# EAGLE design Eharvest (EAGLE 6.5.0)
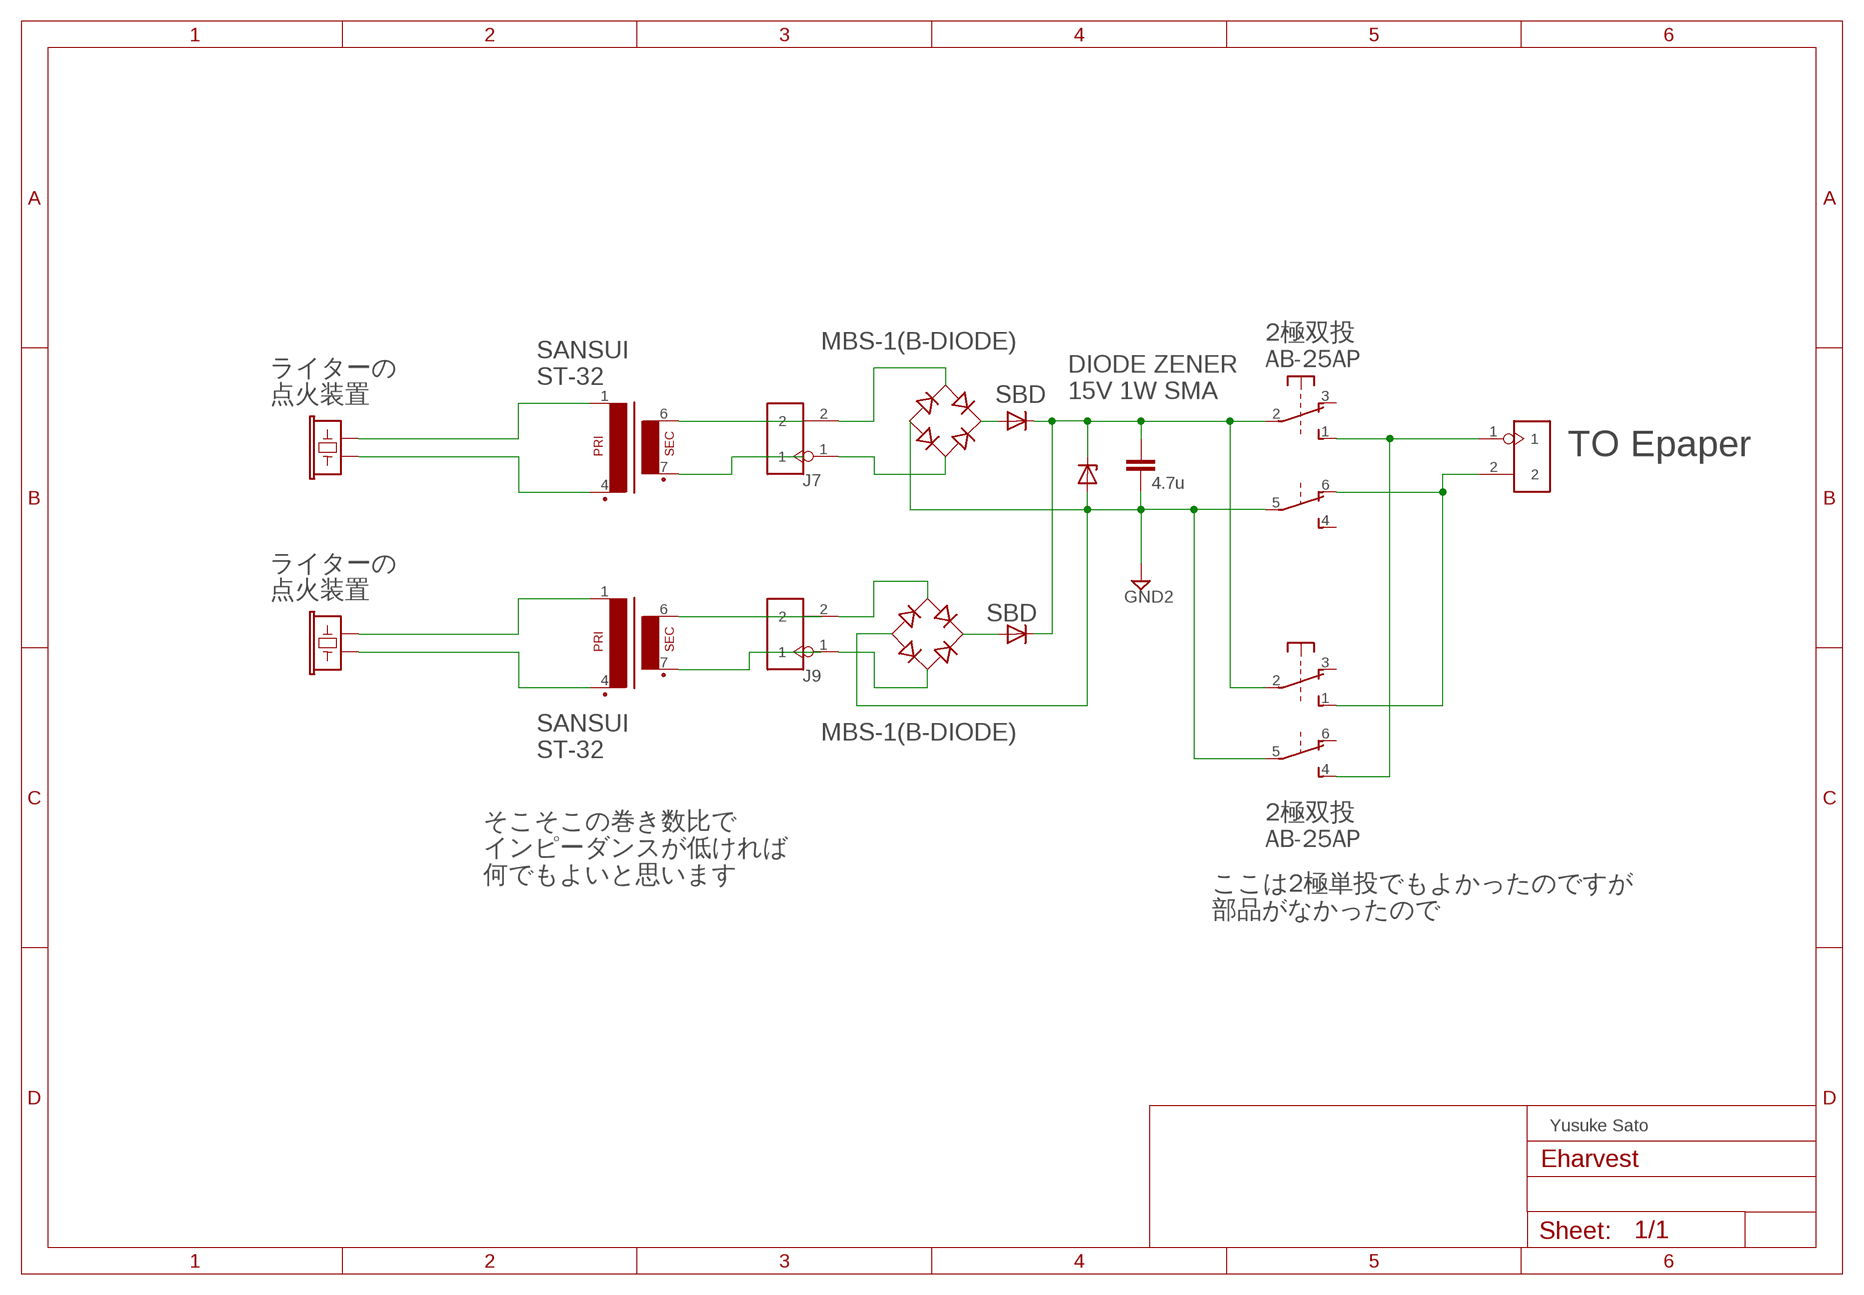
[diagram p0: schematic, sheet 1]

## Parts
C9  4.7u  C-EUC0402K  [C0402K]
D1  1N4728  [DO41Z10]
D5  MBS-1(B-DIODE)  [MBS-1(B-DIODE)]
D7  MBS-1(B-DIODE)  [MBS-1(B-DIODE)]
D8  DIODE-SOD123  [SOD123]
D9  DIODE-SOD123  [SOD123]
J7  HEADER-2P-65/35MIL  [2P-2.54-65/35MIL]
J8  HEADER-2P-65/35MIL  [2P-2.54-65/35MIL]
J9  HEADER-2P-65/35MIL  [2P-2.54-65/35MIL]
S1  9450-2  [9450-2]
S3  9450-2  [9450-2]
U$1  BV20_1P1S  [BV20]
U$2  BV20_1P1S  [BV20]
U$3  MICELECTRET_SMD  [MIC_ELECTRET_SMD]
U$4  MICELECTRET_SMD  [MIC_ELECTRET_SMD]

## Nets
ACIN3: D5.~(AC1) J7.2
ACIN4: D5.~1(AC2) J7.1
ACIN5: D7.~(AC1) J9.2
ACIN6: D7.~1(AC2) J9.1
GND2: C9.2 D1.A D5.- D7.- S1.5(2:P) S3.5(2:P)
N$3: U$1.6(S4)
N$4: C9.1 D1.C D8.C D9.C S1.2(1:P) S3.2(1:P)
N$5: U$1.7(S3)
N$6: J8.1 S1.4(2:S) S3.1(1:S)
N$8: J8.2 S1.1(1:S) S3.6(2:O)
N$9: U$2.7(S3)
N$10: U$2.6(S4)
N$11: D5.+ D8.A
N$12: U$1.1 U$3.2
N$13: U$1.4(P2) U$3.1
N$14: U$2.1 U$4.2
N$15: U$2.4(P2) U$4.1
N$16: D7.+ D9.A
Unconnected: S1.3(1:O) S1.6(2:O) S3.3(1:O) S3.4(2:S)

## Notes on the sheet
- 2極双投
  AB-25AP
- SANSUI 
  ST-32
- DIODE ZENER 
  15V 1W SMA
- ライターの
  点火装置
- SBD
- TO Epaper
- ライターの
  点火装置
- SBD
- SANSUI 
  ST-32
- 2極双投
  AB-25AP
- そこそこの巻き数比で
  インピーダンスが低ければ
  何でもよいと思います
- ここは2極単投でもよかったのですが
  部品がなかったので
- Yusuke Sato

## Library data of the parts
C9 = rcl:C-EU: CAPACITOR, European symbol
D1 = diode:1N4728: Z DIODE 3.3 V, 1W, 5 percent
D5 D7 = Utable:MBS-1(B-DIODE)
D8 D9 = diode:DIODE-: DIODE
J7-J9 = Connector :HEADER-2P
S1 S3 = switch-misc:9450-2: MARQUARDT SWITCH
U$1 U$2 = bv_20:BV20_1P1S
U$3 U$4 = SparkFun-Sensors:MIC: Omni-directional electret microphone. 9.7mm standard diameter.

## Board
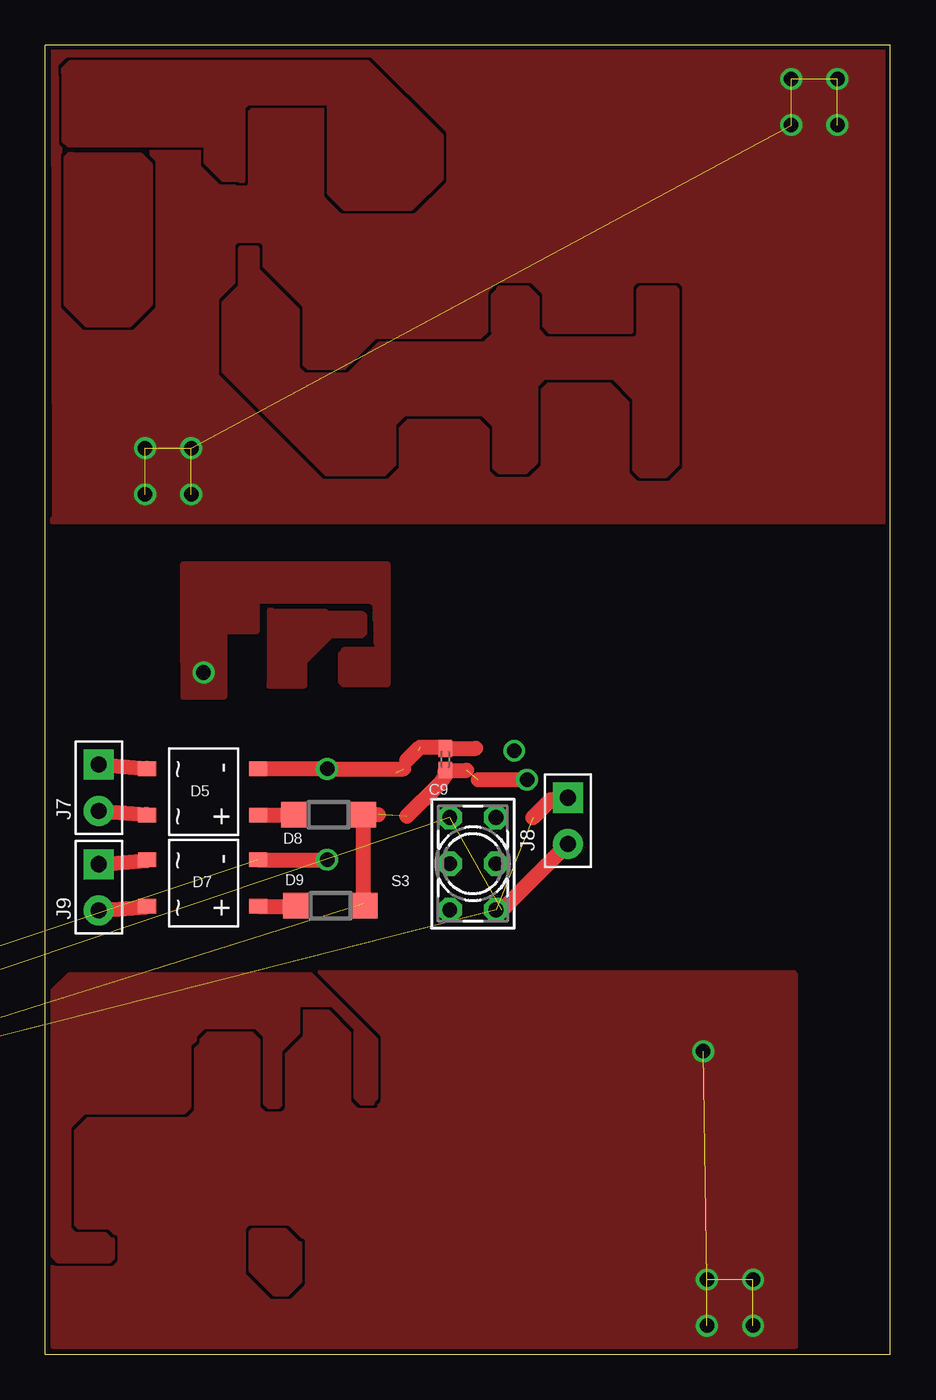
[diagram p1: board, top side]
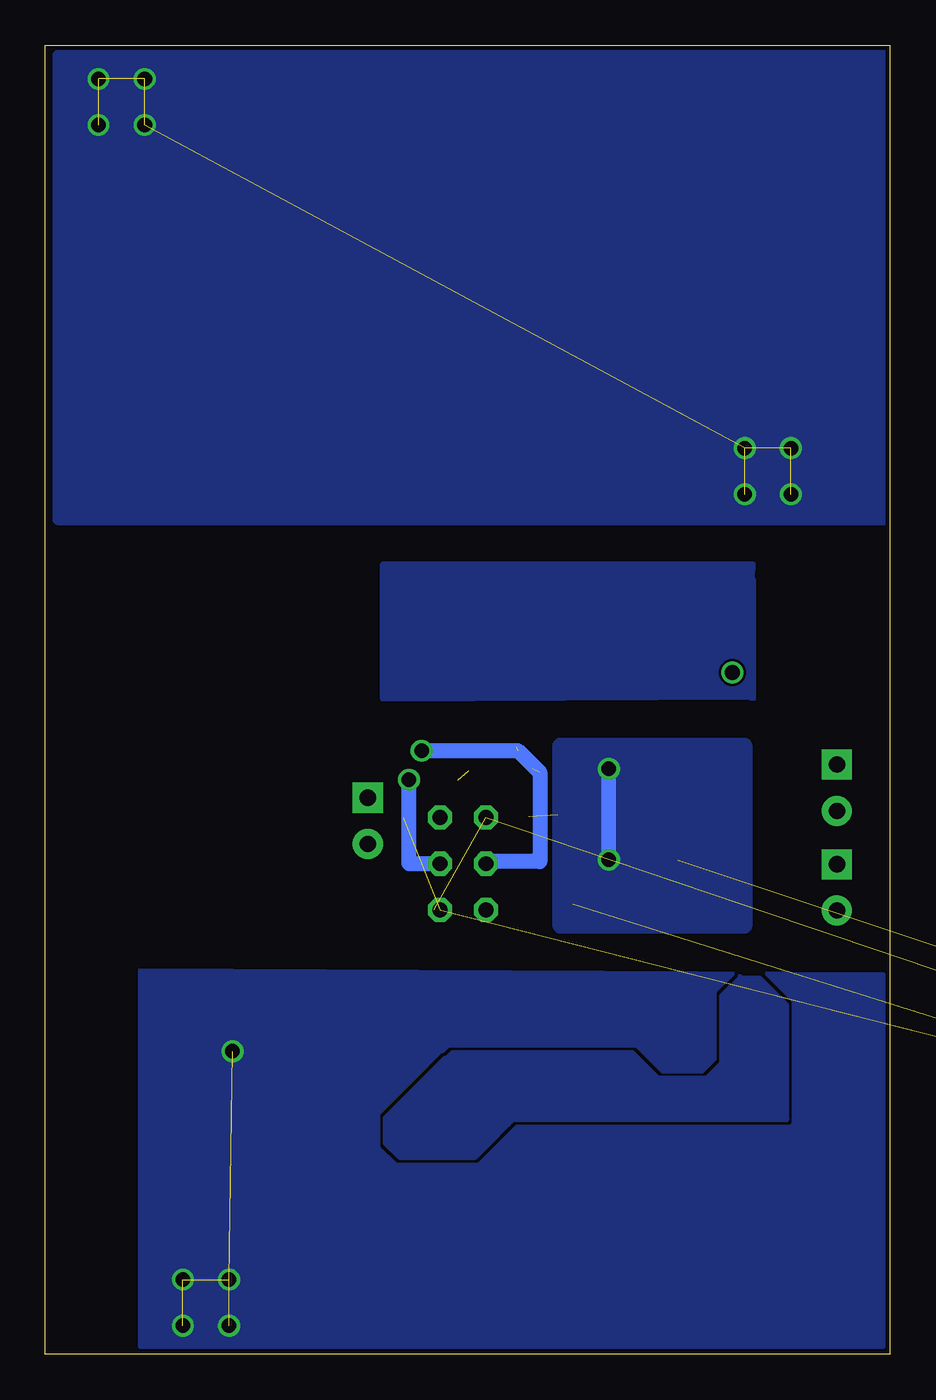
[diagram p2: board, bottom side, seen from below]

Size 46.5 x 72 mm. Coordinates in mm from the lower left corner, seen from the top.
Outline: 0,0 46.5,0 46.5,72 0,72 0,0
Copper layers (1*16): Top 0.035mm / dielectric 1.5mm / Bottom 0.035mm
Design rules "Fusion_eagle_rule_v1.1": minimum track width 6mil, minimum drill 12mil, track to track 6mil, track to pad 6mil, pad to pad 6mil, via to via 6mil, smd to smd 0mil, copper to edge 10mil, drill to drill 10mil, minimum pad ring 10mil, minimum via ring 6mil, stop-mask expansion 2mil, vias tented up to drill 100mil, thermal gap 10mil

### Footprints (pad centres in the part's own frame; a part is rotated, then mirrored left to right if it is on the bottom)
C0402K = smd 0.925 x 0.74: 1 -0.6,0; 2 0.6,0
DO41Z10 = drill 1.118: A 5.08,0; C -5.08,0
MBS-1(B-DIODE) = smd 0.8 x 1: + 0,0; - 2.55,0; ~ 0,6.1; ~1 2.55,6.1
SOD123 = smd 1.4 x 1.4: A 1.9,0; C -1.9,0
2P-2.54-65/35MIL = drill 0.889 pad 1.651 square: 1 0,1.27 | drill 0.889 pad 1.651: 2 0,-1.27
9450-2 = drill 0.813 octagon: 1 -2.54,-1.27; 2 0,-1.27; 3 2.54,-1.27; 4 -2.54,1.27; 5 0,1.27; 6 2.54,1.27
BV20 = drill 0.6 long: 1 -7.5,-7.5; 2 -7.5,-2.5; 3 -7.5,2.5; 4 -7.5,7.5; 5 7.5,7.5; 6 7.5,2.5; 7 7.5,-2.5; 8 7.5,-7.5
MIC_ELECTRET_SMD = smd 1.3 x 1.3: 1 0,0 | smd 0.75 x 0.75: 2 0,1.6

### Placement (x,y rotation side)
C9  22,32.72 90 top
D1  -71.12,-27.94 0 top  (outside the outline)
D5  11.7,29.66 90 top
D7  11.7,24.64 90 top
D8  15.58,29.68 180 top
D9  15.68,24.66 180 top
J7  2.94,31.16 0 top
J8  28.76,29.34 0 top
J9  2.94,25.68 0 top
S1  -73.66,-2.54 0 top  (outside the outline)
S3  23.52,26.98 90 top
U$1  -30.48,5.08 0 top  (outside the outline)
U$2  -55.88,5.08 0 top  (outside the outline)
U$3  -73.66,-12.7 0 top  (outside the outline)
U$4  -73.66,-20.32 0 top  (outside the outline)

### Tracks (layer width: path | path; a pad name or v marks a point on that pad's centre or on a via)
0V  (via drill 0.8)  (4 unrouted)
  other vias: 38.94,4.1 38.94,1.56 36.4,1.56 36.2,16.66 36.4,4.1
  pour Top (rank 2): 0.4,20.9 0.4,0.4 41.3,0.4 41.3,20.9 41.2,21 0.4,21
  pour Bottom (rank 2): 0.4,0.4 41.3,0.4 41.3,21.1 0.4,20.9
15V
  pour Top: 10.8,60.8 10.8,58.7 9.9,57.8 9.9,54.1 15.5,48.5 18.6,48.5 19.1,49 19.1,51.2 19.7,51.8 24.1,51.8 24.8,51.1 24.8,48.8 25,48.6 26.4,48.6 26.9,49.1 26.9,53.3 27.4,53.8 31.3,53.8 32.5,52.6 32.5,48.7 32.8,48.4 34.1,48.4 34.7,49 34.7,58.5 34.6,58.6 32.8,58.6 32.7,58.5 32.7,56 32.5,55.8 27.5,55.8 27,56.3 27,58.1 26.5,58.6 25,58.6 25,58.5 24.7,58.2 24.7,56.3 24.8,56.2 24.8,56.1 24.2,55.5 18.4,55.5 16.7,53.8 14.2,53.8 13.8,54.2 13.8,57.4 11.6,59.6 11.6,60.8
ACIN3
  Top 0.813: J7.2 5.57,29.69 D5.~
ACIN4
  Top 0.813: J7.1 5.58,32.23 D5.~1
ACIN5
  Top 0.813: J9.2 5.57,24.61 D7.~
ACIN6
  Top 0.813: J9.1 5.56,27.15 D7.~1
GND  (via drill 0.8)  (7 unrouted)
  other vias: 5.48,49.84 8.02,49.84 8.02,47.3 5.48,47.3 43.58,70.16 41.04,70.16 41.04,67.62 43.58,67.62
  pour Top (rank 2): 0.4,45.86 46.12,45.86 46.12,71.78 46.1,71.8 0.5,71.8 0.56,45.9 0.5,46
  pour Bottom: 0.3,71.7 0.4,45.8 45.8,45.8 45.9,45.9 45.9,71.5 45.8,71.6
GND2  (via drill 0.8)  (4 unrouted)
  Top 0.813: D7.- v15.49,27.19 v15.5,27.2 | 19.71,32.2 v15.5,32.2 15.39,32.21 D5.- | 19.88,32.66 20.62,33.4 21.92,33.4 C9.2 23.69,33.32 | 25.63,33.27 v25.8,33.2
  Bottom 0.813: v15.5,27.2 v15.5,32.2 | v25.8,33.2 20.5,33.2 19.3,32 19.3,27.1 22.13,27.1 S3.5
  pour Bottom: 8.02,33.5 8.02,23.54 18.18,23.54 18.18,33.5
GNDA  (via drill 0.8)
  other vias: 8.7,37.5
  pour Top: 7.6,39.9 7.6,43.4 18.8,43.4 18.8,36.9 16.4,36.9 16.3,37 16.3,38.5 16.5,38.7 18.3,38.7 18.2,41.3 17.9,41.5 11.7,41.5 11.6,41.4 11.6,39.8 9.76,39.78 9.8,39.74 9.8,36.2 7.62,36.18
N$1
  pour Top: 1.4,65.9 5.2,65.9 5.7,65.4 5.7,57.8 4.6,56.7 2.3,56.7 1.2,57.8 1.2,65.8 1.4,66
N$4  (via drill 0.8)  (4 unrouted)
  Top 0.813: D9.C 17.48,24.76 D8.C 18.33,29.68 | 19.88,29.58 21.7,31.4 22,31.82 C9.1 23.19,32.12 | v26.5,31.6 23.81,31.6
  Bottom 0.813: S3.2 26.48,26.98 26.5,27 v26.5,31.6
N$6  (2 unrouted)
  Top 0.813: 26.82,29.52 27.8,30.5 28.65,30.5 J8.1
N$7
  pour Bottom: 7.7,42.7 7.6,42.6 7.6,36.1 7.8,36.2 27.9,36.1 27.9,43.4 7.6,43.4
N$8  (2 unrouted)
  Top 0.813: 25.13,24.44 J8.2
N$11
  Top 0.813: D5.+ 13.66,29.66 D8.A
N$12  (1 unrouted)
N$13  (1 unrouted)
N$14  (1 unrouted)
N$15  (1 unrouted)
N$16
  Top 0.813: D7.+ 13.76,24.64 D9.A
N$19
  pour Top: 12.3,36.8 12.4,36.9 12.4,40.9 12.5,40.8 15.4,40.8 15.5,40.7 17.4,40.7 17.5,40.6 17.5,39.7 17.4,39.6 15.7,39.6 14.2,38.1 14.2,36.8
N$22
  pour Top: 13.4,3.4 13.3,3.3 12.6,3.3 11.3,4.6 11.3,6.7 11.4,6.8 13.2,6.8 13.9,6.1 14,6.1 14,4
VIN
  pour Top: 2.54,5.08 0.7,5.1 0.4,5.4 0.4,20 1.3,20.9 14.6,20.9 18.2,17.3 18.2,14.1 18,13.9 18,13.8 17.4,13.8 17.1,14.1 17.1,17.9 15.8,19.2 13.9,19.2 13.9,17.7 12.9,16.7 12.9,13.7 12.8,13.6 12.3,13.6 12.1,13.8 12.1,17.5 11.6,18 8.7,18 8.2,17.5 8.2,17.3 7.9,17 7.9,13.6 7.6,13.3 2.1,13.3 1.3,12.5 1.3,6.9 1.6,6.6 3.3,6.6 3.6,6.3 3.7,6.3 3.7,5.3 3.5,5.1 2.6,5.1
  pour Bottom: 7.2,20.7 5.7,19.2 5.7,12.9 20.8,12.9 22.9,10.8 27,10.8 27.8,11.6 27.8,13 24.5,16.3 24.4,16.3 24.1,16.6 14.2,16.6 12.8,15.2 10.1,15.2 9.3,16 9.3,19.7 8.3,20.7 8.3,20.8 8.2,20.7
VIN1
  pour Top: 1.1,70.6 1.1,66.8 1.3,66.6 8.8,66.6 8.9,66.5 8.9,65.6 9.8,64.7 10.7,64.7 10.8,64.6 10.8,68.6 11.1,68.9 15.6,68.9 15.7,69 15.7,63.9 16.5,63.1 20.1,63.1 21.7,64.7 21.7,67 17.7,71 1.4,71 1,70.6

### Text on the board
Document: VDD